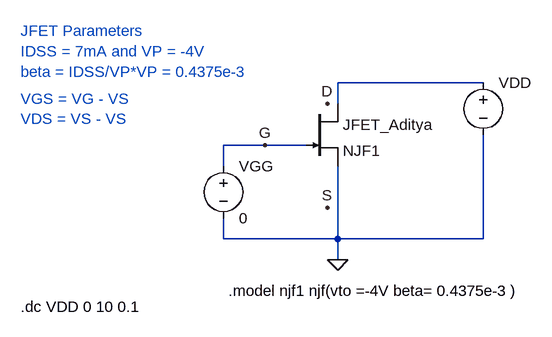
[diagram p0: schematic JFET_Output_Transfer_Characteristics.asc]
JFET_Output_Transfer_Characteristics.asc, the LTspice schematic file:
Version 4
SHEET 1 880 680
WIRE 432 96 208 96
WIRE 208 128 208 96
WIRE 96 192 32 192
WIRE 160 192 96 192
WIRE 32 224 32 192
WIRE 32 336 32 304
WIRE 208 336 208 224
WIRE 208 336 32 336
WIRE 432 336 432 176
WIRE 432 336 208 336
WIRE 208 368 208 336
FLAG 208 368 0
FLAG 96 192 G
FLAG 192 288 S
FLAG 192 128 D
SYMBOL njf 160 128 R0
SYMATTR InstName JFET_Aditya
SYMATTR Value NJF1
SYMBOL voltage 432 80 R0
WINDOW 123 0 0 Left 0
WINDOW 39 0 0 Left 0
SYMATTR InstName VDD
SYMATTR Value ""
SYMBOL voltage 32 208 R0
WINDOW 123 0 0 Left 0
WINDOW 39 0 0 Left 0
SYMATTR InstName VGG
SYMATTR Value 0
TEXT -280 16 Left 2 ;JFET Parameters \nIDSS = 7mA and VP = -4V\nbeta = IDSS/VP*VP = 0.4375e-3
TEXT 40 416 Left 2 !.model njf1 njf(vto =-4V beta= 0.4375e-3 )
TEXT -280 120 Left 2 ;VGS = VG - VS\nVDS = VS - VS
TEXT -280 440 Left 2 !.dc VDD 0 10 0.1

The netlist it stands for:
* JFET_Output_Transfer_Characteristics.asc
JFET_Aditya N001 G 0 NJF1
VDD N001 0
VGG G 0 0
.model NJF NJF
.model PJF PJF
.lib standard.jft
* JFET Parameters
* IDSS = 7mA and VP = -4V
* beta = IDSS/VP*VP = 0.4375e-3
.model njf1 njf(vto =-4V beta= 0.4375e-3 )
* VGS = VG - VS
* VDS = VS - VS
.dc VDD 0 10 0.1
.backanno
.end